# EAGLE schematic PCM1794_DAC_Test_V1 (EAGLE 6.4)

## Sheet 1 of 3: DAC
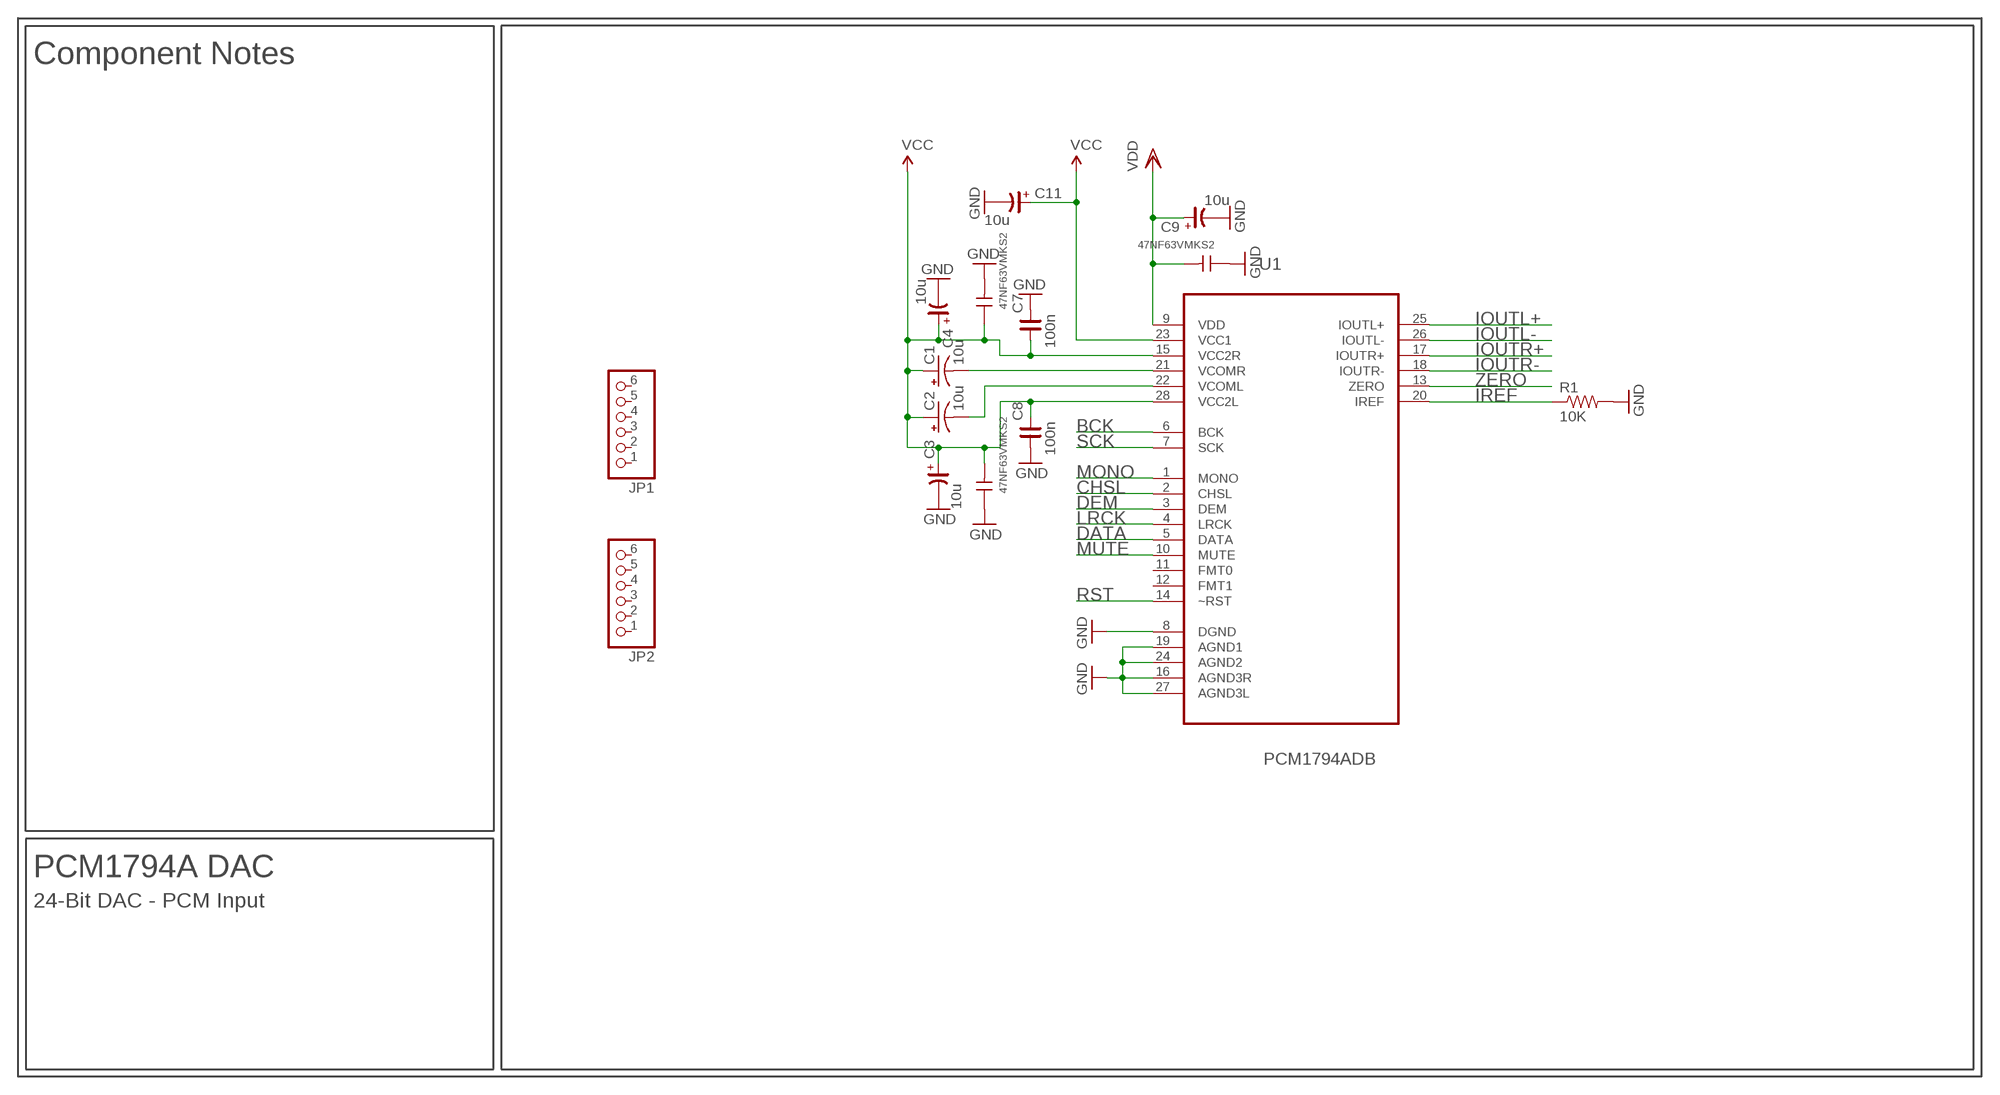
[diagram p0: schematic, sheet 1]

### Parts
C1  10u  CPOL-USA  [PANASONIC_A]
C2  10u  CPOL-USA  [PANASONIC_A]
C3  10u  CP_E-020X050  [CE-020X050]
C4  10u  CP_E-020X050  [CE-020X050]
C5  47NF63VMKS2  [2,5X6,5RM5,0]
C6  47NF63VMKS2  [2,5X6,5RM5,0]
C7  100n  C_0603  [C0603]
C8  100n  C_0603  [C0603]
C9  10u  CP_E-020X050  [CE-020X050]
C10  47NF63VMKS2  [2,5X6,5RM5,0]
C11  10u  CP_E-020X050  [CE-020X050]
JP1  PINHD-1X6  [1X06]
JP2  PINHD-1X6  [1X06]
R1  10K  R-US_R0603  [R0603]
U1  PCM1794ADB  [SOP65P780X200-28N]

### Nets
BCK: U1.6(BCK)
CHSL: U1.2(CHSL)
DATA: U1.5(DATA)
DEM: U1.3(DEM)
GND: C3.- C4.- C5.2 C6.1 C7.2 C8.1 C9.- C10.1 C11.- R1.2 U1.8(DGND) U1.16(AGND3R) U1.19(AGND1) U1.24(AGND2) U1.27(AGND3L) ; also sheet 2,3
IOUTL+: U1.25(IOUTL+) ; also sheet 2
IOUTL-: U1.26(IOUTL-) ; also sheet 2
IOUTR+: U1.17(IOUTR+) ; also sheet 2
IOUTR-: U1.18(IOUTR-) ; also sheet 2
IREF: R1.1 U1.20(IREF)
LRCK: U1.4(LRCK)
MONO: U1.1(MONO)
MUTE: U1.10(MUTE)
N$2: C1.- U1.21(VCOMR)
N$4: C2.- U1.22(VCOML)
RST: U1.14(~RST)
SCK: U1.7(SCK)
VCC: C1.+ C2.+ C3.+ C4.+ C5.1 C6.2 C7.1 C8.2 C11.+ U1.15(VCC2R) U1.23(VCC1) U1.28(VCC2L)
VDD: C9.+ C10.2 U1.9(VDD)
ZERO: U1.13(ZERO)
Unconnected: JP1.1 JP1.2 JP1.3 JP1.4 JP1.5 JP1.6 JP2.1 JP2.2 JP2.3 JP2.4 JP2.5 JP2.6 U1.11(FMT0) U1.12(FMT1)

### Notes on the sheet
- Component Notes
- PCM1794A DAC
- 24-Bit DAC - PCM Input

## Sheet 2 of 3: I/V Stage
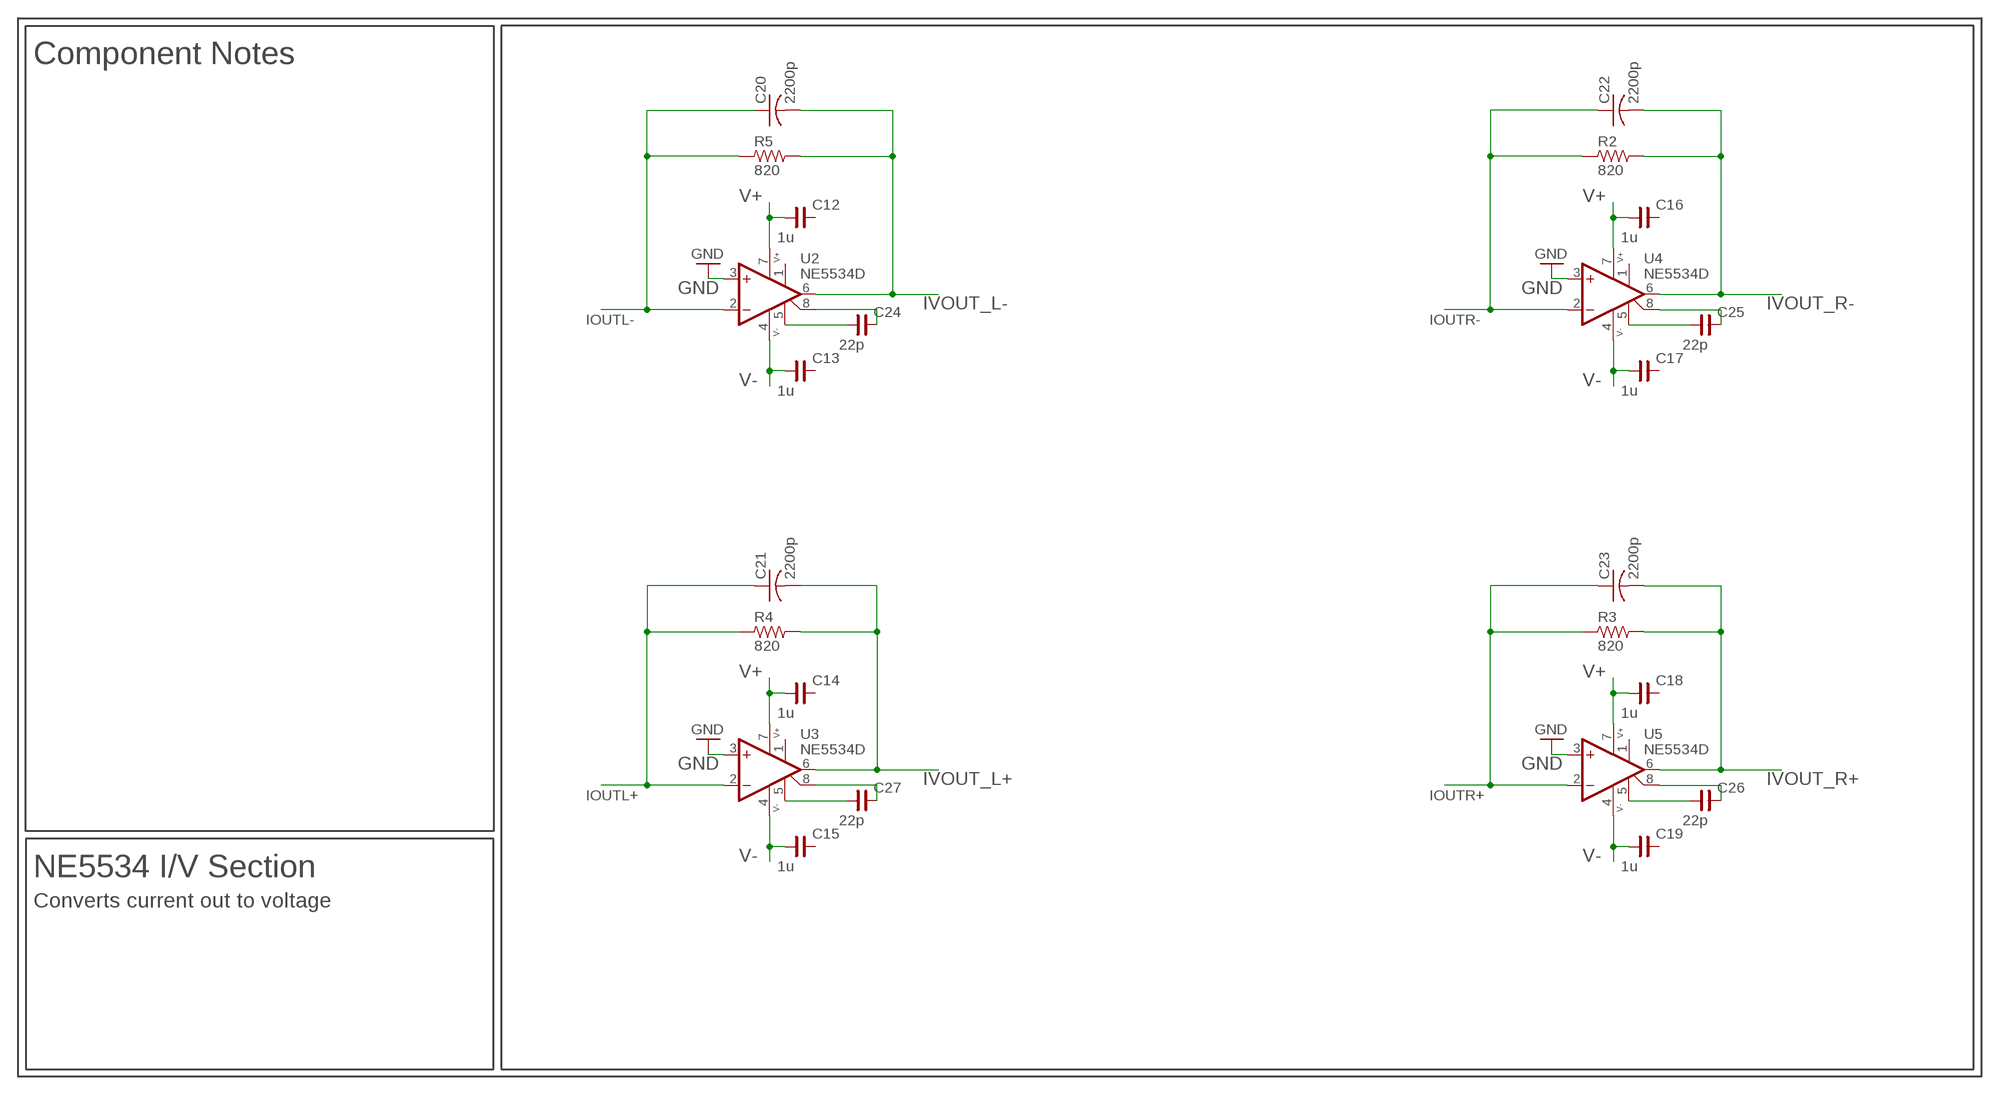
[diagram p1: schematic, sheet 2]

### Parts
C12  1u  C_0603  [C0603]
C13  1u  C_0603  [C0603]
C14  1u  C_0603  [C0603]
C15  1u  C_0603  [C0603]
C16  1u  C_0603  [C0603]
C17  1u  C_0603  [C0603]
C18  1u  C_0603  [C0603]
C19  1u  C_0603  [C0603]
C20  2200p  C-USC0805  [C0805]
C21  2200p  C-USC0805  [C0805]
C22  2200p  C-USC0805  [C0805]
C23  2200p  C-USC0805  [C0805]
C24  22p  C_0603  [C0603]
C25  22p  C_0603  [C0603]
C26  22p  C_0603  [C0603]
C27  22p  C_0603  [C0603]
R2  820  R_0603  [R0603]
R3  820  R_0603  [R0603]
R4  820  R_0603  [R0603]
R5  820  R_0603  [R0603]
U2  NE5534D  [SO08]
U3  NE5534D  [SO08]
U4  NE5534D  [SO08]
U5  NE5534D  [SO08]

### Nets
GND: U2.3(A:+IN) U3.3(A:+IN) U4.3(A:+IN) U5.3(A:+IN) ; also sheet 1,3
IOUTL+: C21.1 R4.1 U3.2(A:-IN) ; also sheet 1
IOUTL-: C20.1 R5.1 U2.2(A:-IN) ; also sheet 1
IOUTR+: C23.1 R3.1 U5.2(A:-IN) ; also sheet 1
IOUTR-: C22.1 R2.1 U4.2(A:-IN) ; also sheet 1
IVOUT_L+: C21.2 R4.2 U3.6(A:OUT) ; also sheet 3
IVOUT_L-: C20.2 R5.2 U2.6(A:OUT) ; also sheet 3
IVOUT_R+: C23.2 R3.2 U5.6(A:OUT) ; also sheet 3
IVOUT_R-: C22.2 R2.2 U4.6(A:OUT) ; also sheet 3
N$13: C27.1 U3.5(-BALCOMP:CMP)
N$14: C27.2 U3.8(-BALCOMP:BAL/CMP)
N$15: C24.1 U2.5(-BALCOMP:CMP)
N$16: C24.2 U2.8(-BALCOMP:BAL/CMP)
N$17: C25.1 U4.5(-BALCOMP:CMP)
N$18: C25.2 U4.8(-BALCOMP:BAL/CMP)
N$19: C26.1 U5.5(-BALCOMP:CMP)
N$20: C26.2 U5.8(-BALCOMP:BAL/CMP)
V+: C12.1 C14.1 C16.1 C18.1 U2.7(P:V+) U3.7(P:V+) U4.7(P:V+) U5.7(P:V+) ; also sheet 3
V-: C13.1 C15.1 C17.1 C19.1 U2.4(P:V-) U3.4(P:V-) U4.4(P:V-) U5.4(P:V-) ; also sheet 3
Unconnected: C12.2 C13.2 C14.2 C15.2 C16.2 C17.2 C18.2 C19.2 U2.1(-BAL:BAL) U3.1(-BAL:BAL) U4.1(-BAL:BAL) U5.1(-BAL:BAL)

### Notes on the sheet
- Component Notes
- NE5534 I/V Section
- Converts current out to voltage

## Sheet 3 of 3: DAC Final Out
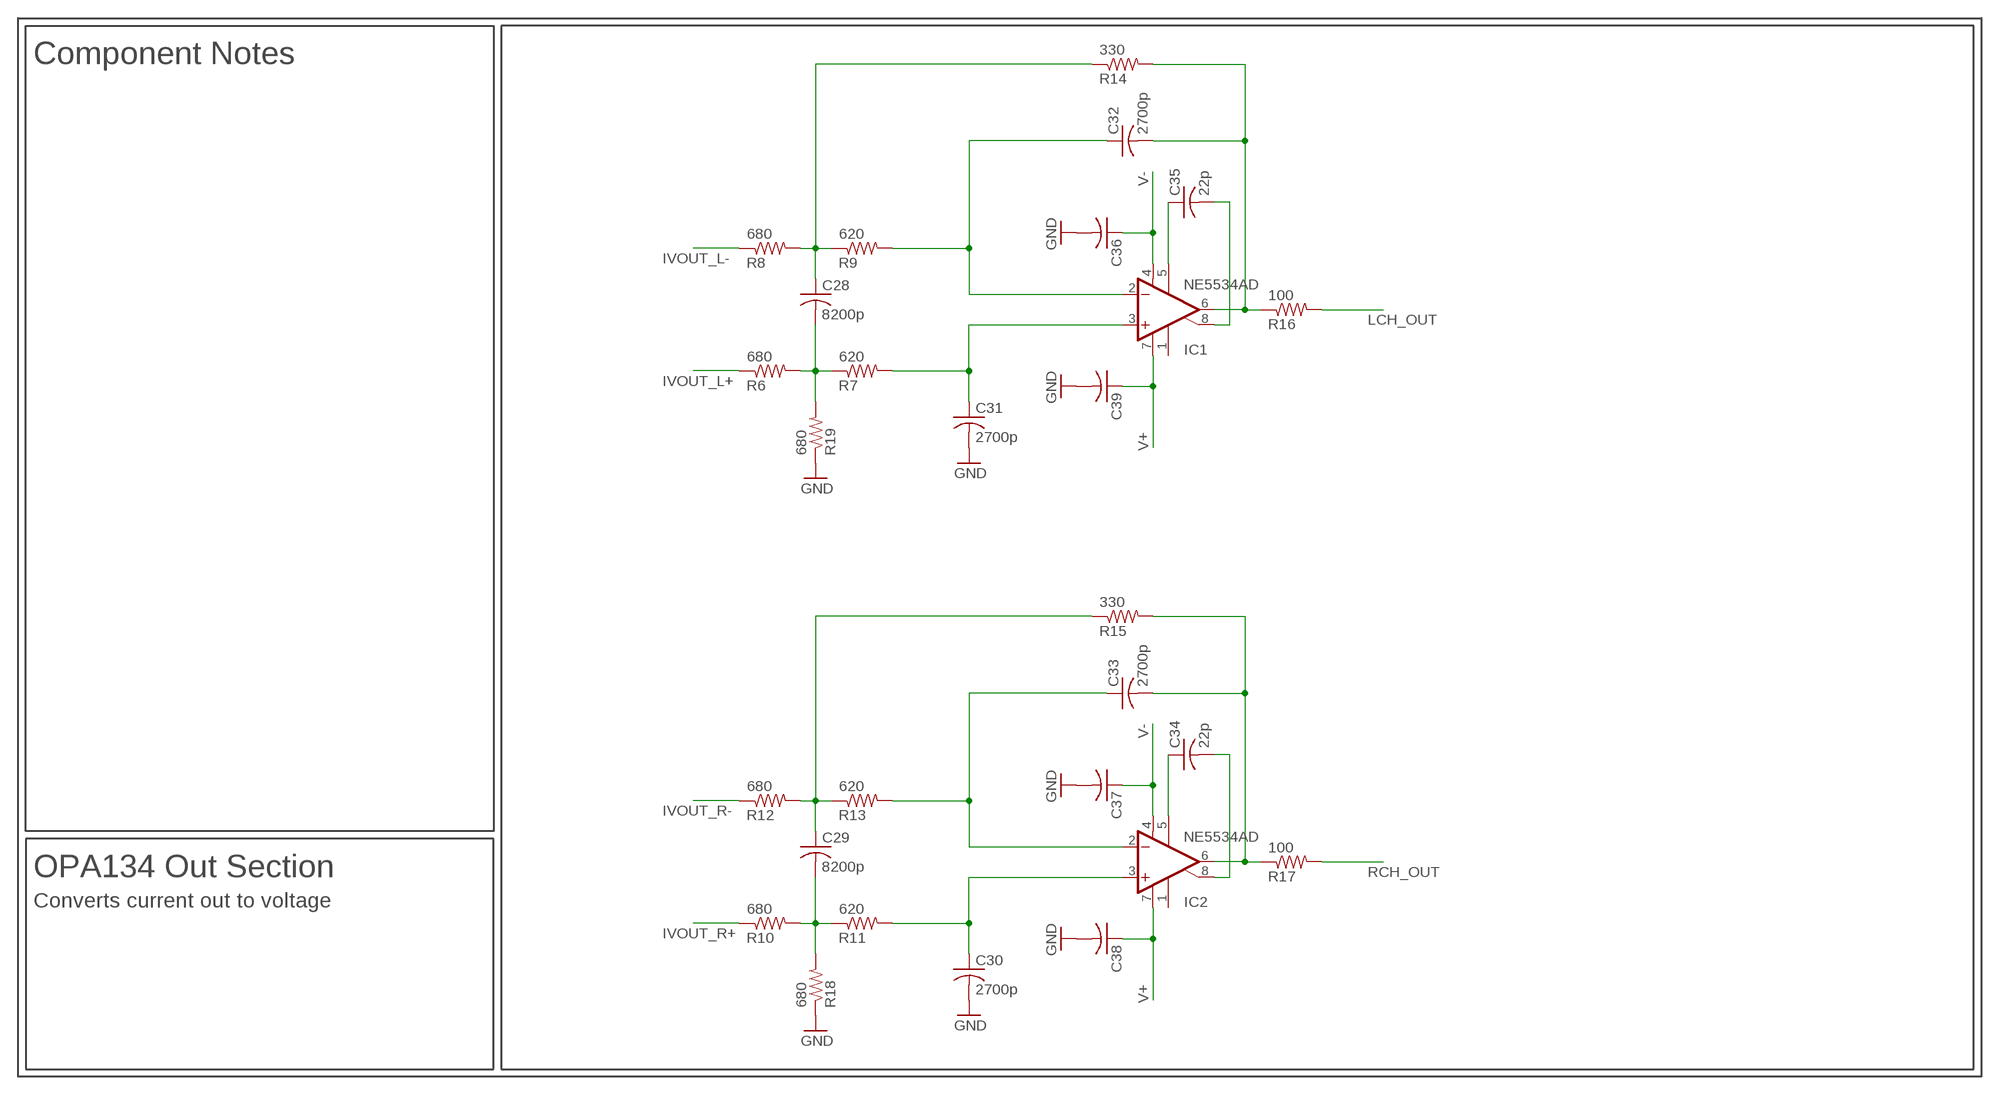
[diagram p2: schematic, sheet 3]

### Parts
C28  8200p  C-USC0805  [C0805]
C29  8200p  C-USC0805  [C0805]
C30  2700p  C-USC0805  [C0805]
C31  2700p  C-USC0805  [C0805]
C32  2700p  C-USC0805  [C0805]
C33  2700p  C-USC0805  [C0805]
C34  22p  C-USC0603  [C0603]
C35  22p  C-USC0603  [C0603]
C36  C-USC0603  [C0603]
C37  C-USC0603  [C0603]
C38  C-USC0603  [C0603]
C39  C-USC0603  [C0603]
IC1  NE5534AD  [SO08]
IC2  NE5534AD  [SO08]
R6  680  R-US_R0805  [R0805]
R7  620  R-US_R0805  [R0805]
R8  680  R-US_R0805  [R0805]
R9  620  R-US_R0805  [R0805]
R10  680  R-US_R0805  [R0805]
R11  620  R-US_R0805  [R0805]
R12  680  R-US_R0805  [R0805]
R13  620  R-US_R0805  [R0805]
R14  330  R-US_R0805  [R0805]
R15  330  R-US_R0805  [R0805]
R16  100  R-US_R0805  [R0805]
R17  100  R-US_R0805  [R0805]
R18  680  R-US_R0805  [R0805]
R19  680  R-US_R0805  [R0805]

### Nets
GND: C30.2 C31.2 C36.2 C37.2 C38.2 C39.2 R18.1 R19.1 ; also sheet 1,2
IVOUT_L+: R6.1 ; also sheet 2
IVOUT_L-: R8.1 ; also sheet 2
IVOUT_R+: R10.1 ; also sheet 2
IVOUT_R-: R12.1 ; also sheet 2
LCH_OUT: R16.2
N$1: C32.2 IC1.6(OUT) R14.2 R16.1
N$6: C33.2 IC2.6(OUT) R15.2 R17.1
N$10: C35.1 IC1.5(CMP)
N$11: C35.2 IC1.8(ON/CMP)
N$12: C29.1 R12.2 R13.1 R15.1
N$21: C29.2 R10.2 R11.1 R18.2
N$22: C28.1 R8.2 R9.1 R14.1
N$23: C28.2 R6.2 R7.1 R19.2
N$24: C31.1 IC1.3(+IN) R7.2
N$25: C32.1 IC1.2(-IN) R9.2
N$26: C30.1 IC2.3(+IN) R11.2
N$27: C33.1 IC2.2(-IN) R13.2
N$28: C34.1 IC2.5(CMP)
N$29: C34.2 IC2.8(ON/CMP)
RCH_OUT: R17.2
V+: C38.1 C39.1 IC1.7(V+) IC2.7(V+) ; also sheet 2
V-: C36.1 C37.1 IC1.4(V-) IC2.4(V-) ; also sheet 2
Unconnected: IC1.1(ON) IC2.1(ON)

### Notes on the sheet
- Component Notes
- OPA134 Out Section
- Converts current out to voltage

## Library data of the parts
C1 C2 = rcl:CPOL-US: POLARIZED CAPACITOR, American symbol
C3 C4 C9 C11 = rc-master:CP_: POLARIZED CAP
C5 C6 C10 = wima_c:47NF63V
C7 C8 C12-C19 C24-C27 = rc-master:C_: NON-POLARIZED CAP
C20-C23 C28-C39 = rcl:C-US: CAPACITOR, American symbol
IC1 IC2 = linear:NE5534: LOW-NOISE OPERATIONAL AMPLIFIER Source: http://focus.ti.com/lit/ds/symlink/ne5534.pdf
JP1 JP2 = pinhead_no_text:PINHD-1X6: PIN HEADER
R1 R6-R19 = rcl:R-US_: RESISTOR, American symbol
R2-R5 = rc-master:R_: RESISTOR
U1 = Texas Instruments_By_element14_Batch_1:PCM1794ADB: 24-Bit 192khz Sampling advanced segment Audio stereo digital-to-analog converter; MPN: PCM1794ADB; OC_FARNELL: 1755014; OC_NEWARK: 54K0199; PACKAGE: SSOP-28; SUPPLIER: Texas Instruments
U2-U5 = op-amp:NE5534: OP-AMP